# EAGLE schematic V-00780-00 (EAGLE 7.2.0)
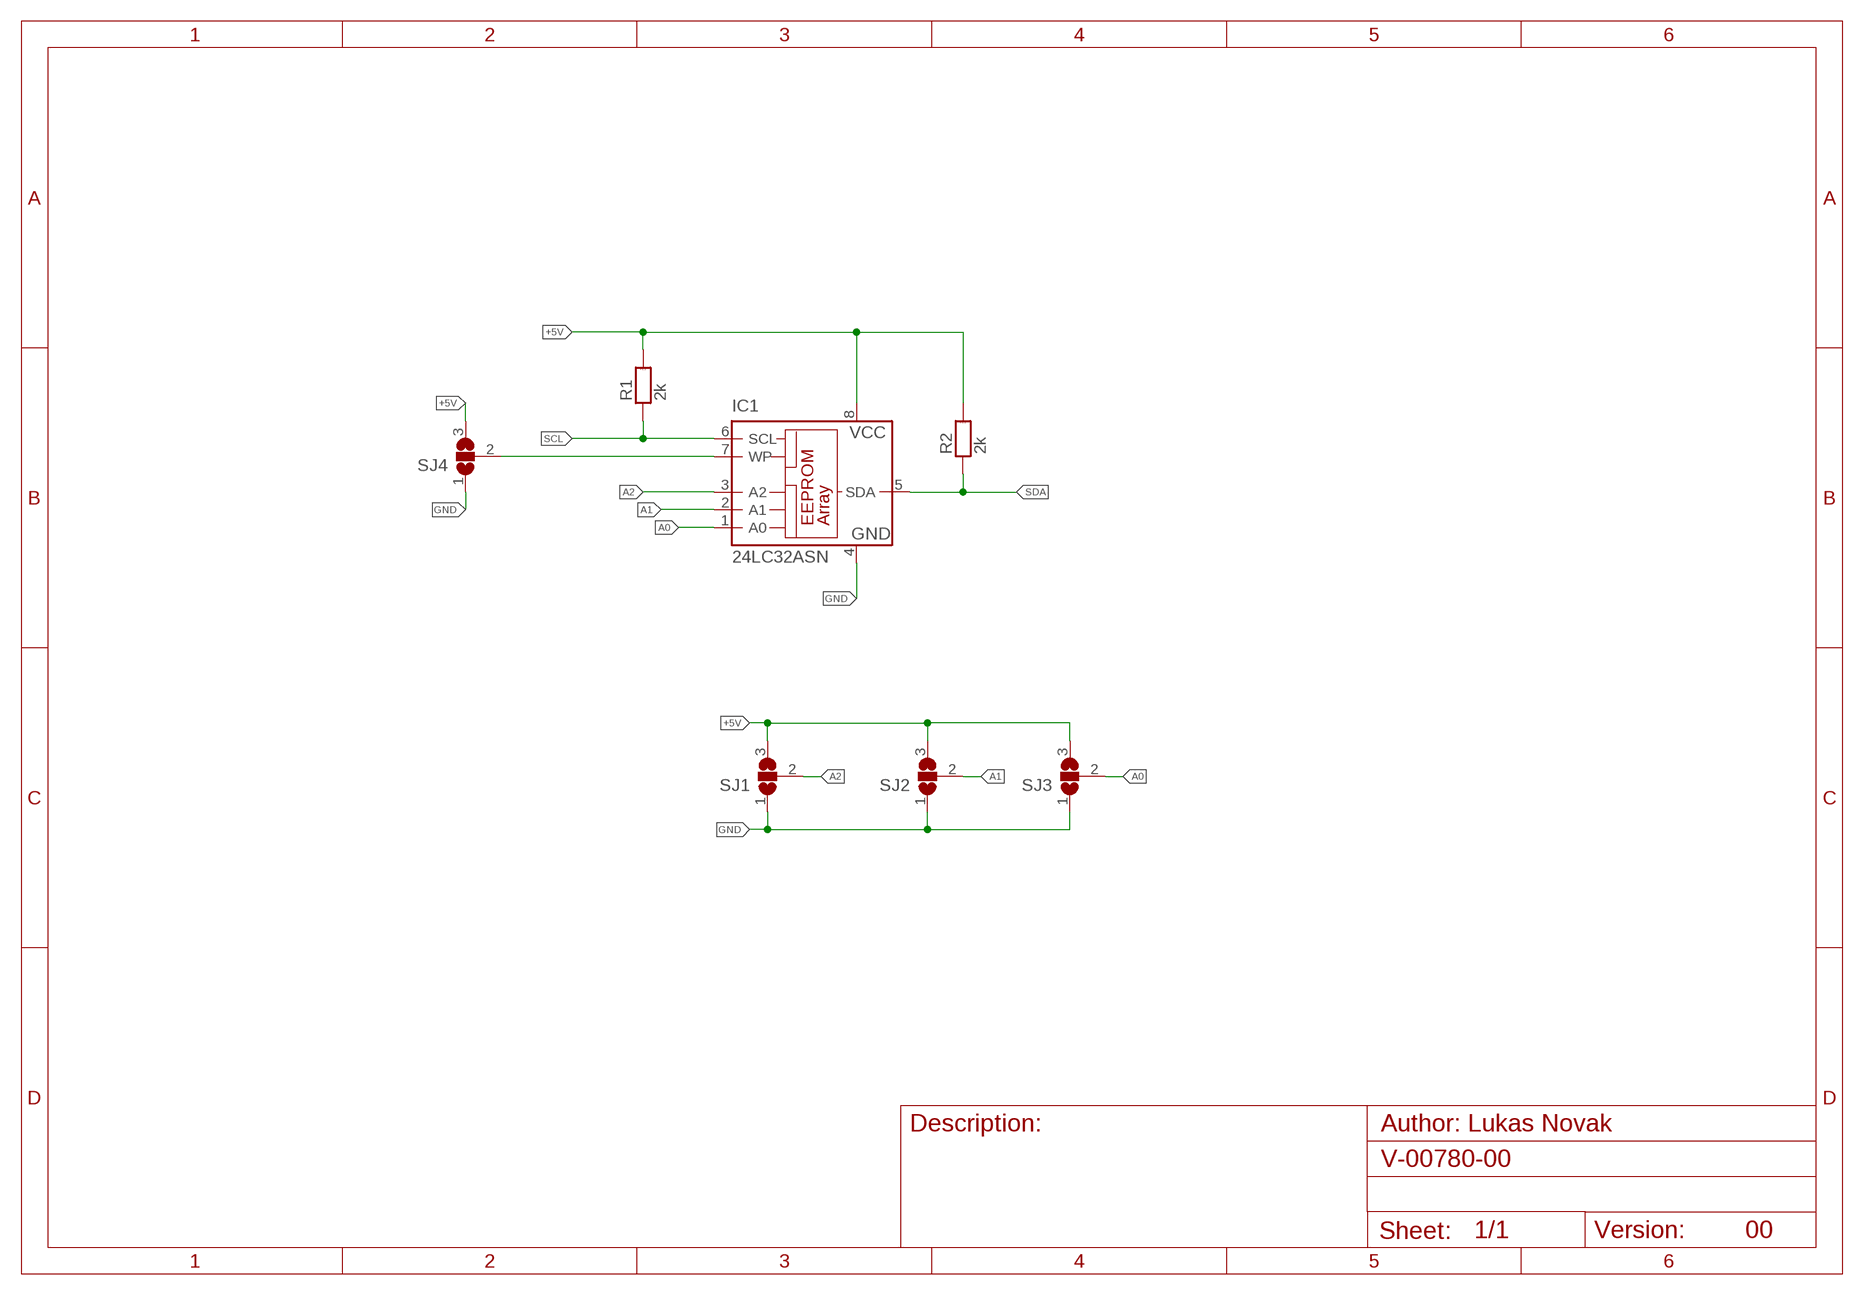
[diagram p0: schematic, sheet 1]

## Parts
IC1  24LC32ASN  [SO-08]
R1  2k  R_1206  [1206]
R2  2k  R_1206  [1206]
SJ1  SJ2W  [SJ_2]
SJ2  SJ2W  [SJ_2]
SJ3  SJ2W  [SJ_2]
SJ4  SJ2W  [SJ_2]

## Nets
+5V: IC1.8(VCC) R1.2 R2.2 SJ1.3 SJ2.3 SJ3.3 SJ4.3
A0: IC1.1(A0) SJ3.2
A1: IC1.2(A1) SJ2.2
A2: IC1.3(A2) SJ1.2
GND: IC1.4(GND) SJ1.1 SJ2.1 SJ3.1 SJ4.1
SCL: IC1.6(SCL) R1.1
SDA: IC1.5(SDA) R2.1
WR_ENABLE: IC1.7(WP) SJ4.2

## Notes on the sheet
- 00

## Library data of the parts
IC1 = microchip:24*: Serial EEPROM I2C; MF: MICROCHIP; MPN: 24LC32A/SN; OC_FARNELL: 9758003; OC_NEWARK: 33C2976
R1 R2 = #PaJa_31:R: Rezistor
SJ1-SJ4 = jumper:SJ2W: SMD solder JUMPER